# EAGLE design dim8_v3 (EAGLE 5.11)

## Sheet 1 of 2
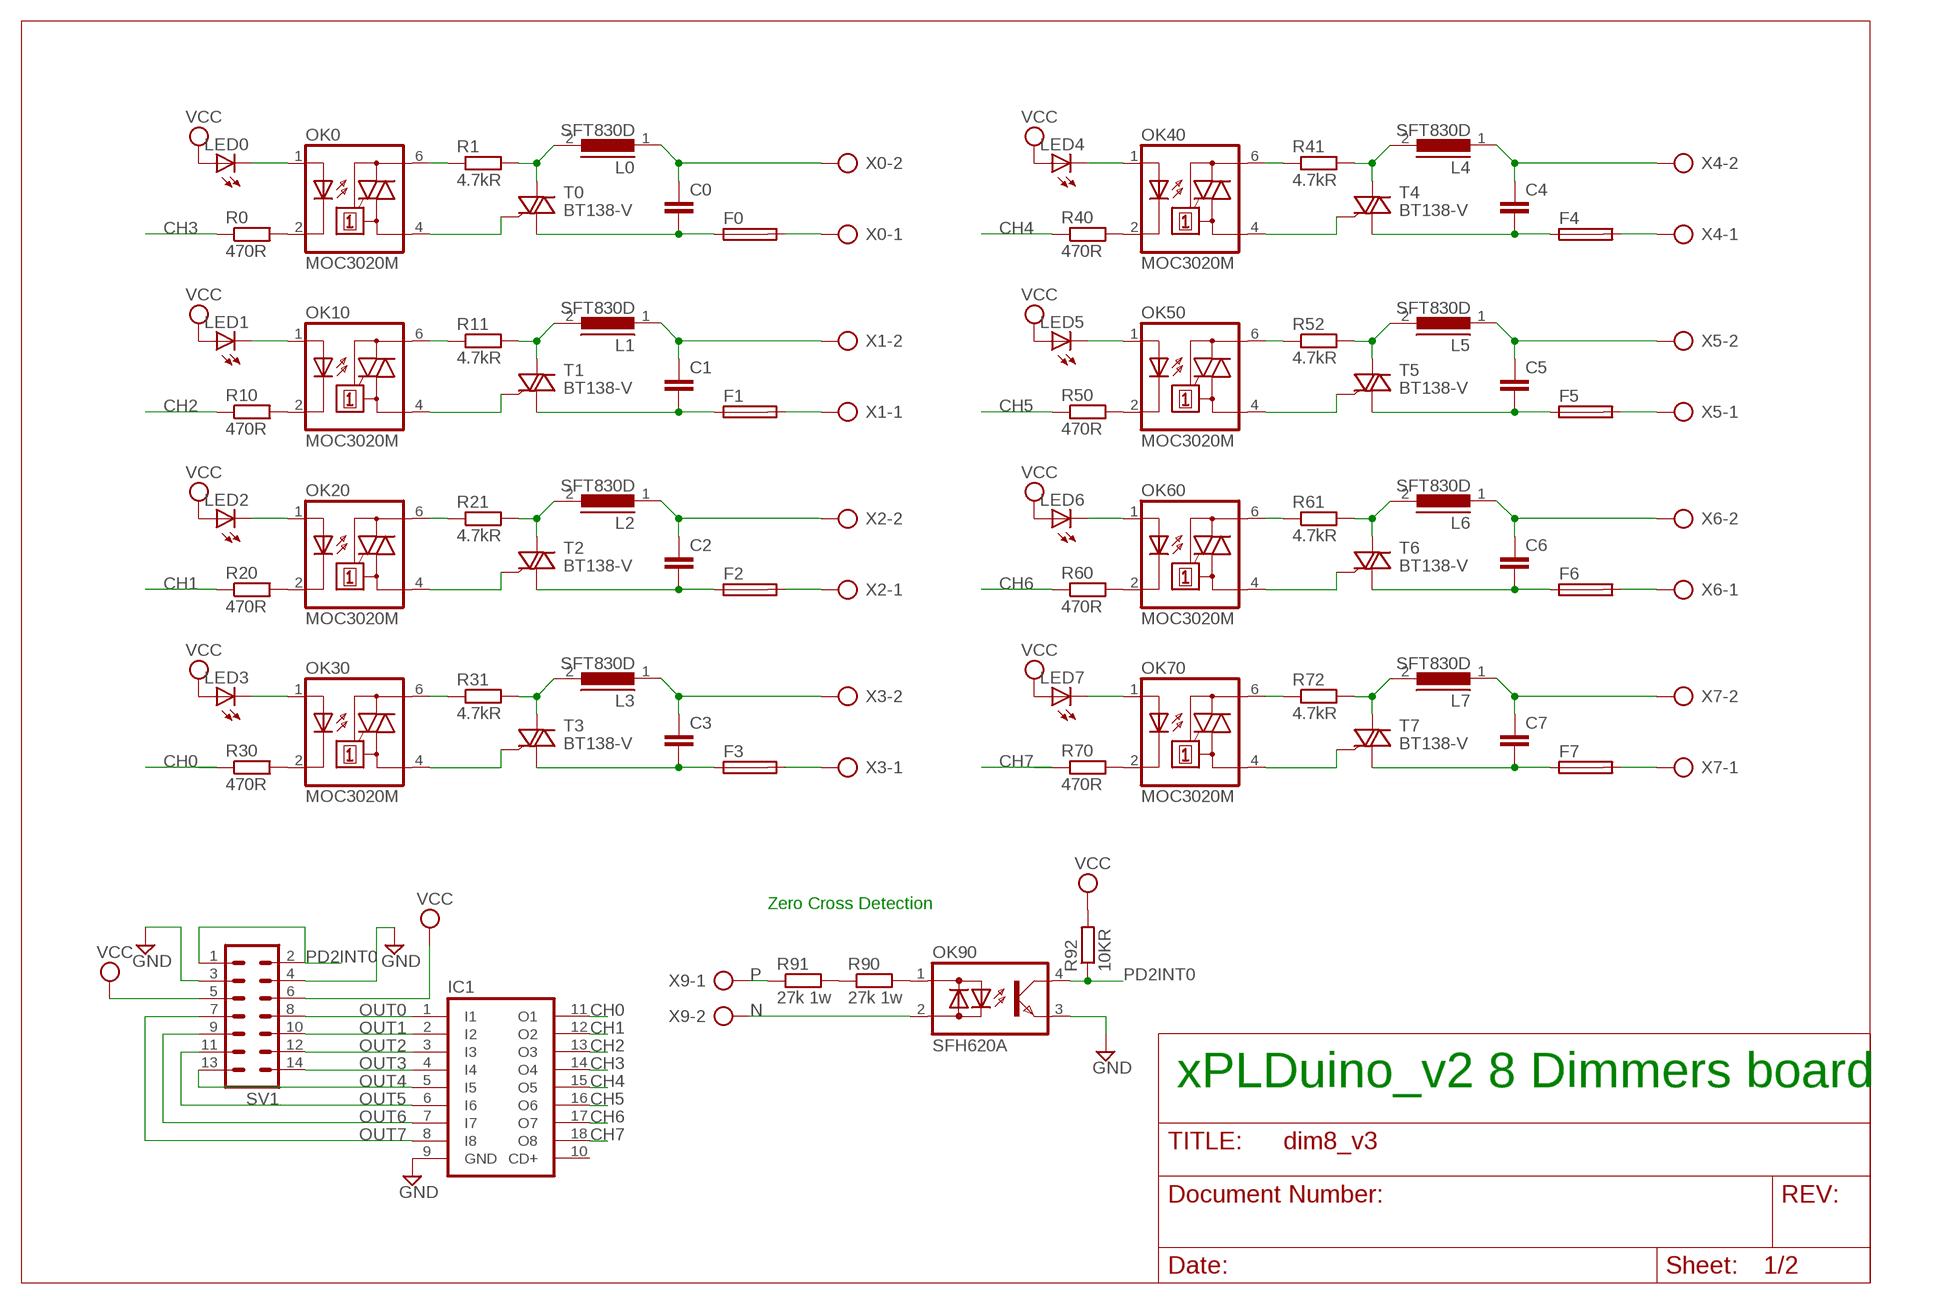
[diagram p0: schematic, sheet 1]

### Parts
C0  C10/5  [C10B5]
C1  C10/5  [C10B5]
C2  C10/5  [C10B5]
C3  C10/5  [C10B5]
C4  C10/5  [C10B5]
C5  C10/5  [C10B5]
C6  C10/5  [C10B5]
C7  C10/5  [C10B5]
F0  SH22,5A  [SH22,5A]
F1  SH22,5A  [SH22,5A]
F2  SH22,5A  [SH22,5A]
F3  SH22,5A  [SH22,5A]
F4  SH22,5A  [SH22,5A]
F5  SH22,5A  [SH22,5A]
F6  SH22,5A  [SH22,5A]
F7  SH22,5A  [SH22,5A]
IC1  ULN2803ASO18  [SO18W]
L0  SFT830D  [SFT830D]
L1  SFT830D  [SFT830D]
L2  SFT830D  [SFT830D]
L3  SFT830D  [SFT830D]
L4  SFT830D  [SFT830D]
L5  SFT830D  [SFT830D]
L6  SFT830D  [SFT830D]
L7  SFT830D  [SFT830D]
LED0  LED3MM  [LED3MM]
LED1  LED3MM  [LED3MM]
LED2  LED3MM  [LED3MM]
LED3  LED3MM  [LED3MM]
LED4  LED3MM  [LED3MM]
LED5  LED3MM  [LED3MM]
LED6  LED3MM  [LED3MM]
LED7  LED3MM  [LED3MM]
OK0  MOC3020M  [DIL06]
OK10  MOC3020M  [DIL06]
OK20  MOC3020M  [DIL06]
OK30  MOC3020M  [DIL06]
OK40  MOC3020M  [DIL06]
OK50  MOC3020M  [DIL06]
OK60  MOC3020M  [DIL06]
OK70  MOC3020M  [DIL06]
OK90  SFH620A  [DIL04]
R0  470R  R-EU_0204/7  [0204/7]
R1  4.7kR  R-EU_0204/7  [0204/7]
R10  470R  R-EU_0204/7  [0204/7]
R11  4.7kR  R-EU_0204/7  [0204/7]
R20  470R  R-EU_0204/7  [0204/7]
R21  4.7kR  R-EU_0204/7  [0204/7]
R30  470R  R-EU_0204/7  [0204/7]
R31  4.7kR  R-EU_0204/7  [0204/7]
R40  470R  R-EU_0204/7  [0204/7]
R41  4.7kR  R-EU_0204/7  [0204/7]
R50  470R  R-EU_0204/7  [0204/7]
R52  4.7kR  R-EU_0204/7  [0204/7]
R60  470R  R-EU_0204/7  [0204/7]
R61  4.7kR  R-EU_0204/7  [0204/7]
R70  470R  R-EU_0204/7  [0204/7]
R72  4.7kR  R-EU_0204/7  [0204/7]
R90  27k 1w  R-EU_0204/7  [0204/7]
R91  27k 1w  R-EU_0204/7  [0204/7]
R92  10KR  R-EU_0204/7  [0204/7]
SV1  MA07-2  [MA07-2]
T0  BT138-V  [TO220BV]
T1  BT138-V  [TO220BV]
T2  BT138-V  [TO220BV]
T3  BT138-V  [TO220BV]
T4  BT138-V  [TO220BV]
T5  BT138-V  [TO220BV]
T6  BT138-V  [TO220BV]
T7  BT138-V  [TO220BV]
X0  AK500/2-H  [AK500/2-H]
X1  AK500/2-H  [AK500/2-H]
X2  AK500/2-H  [AK500/2-H]
X3  AK500/2-H  [AK500/2-H]
X4  AK500/2-H  [AK500/2-H]
X5  AK500/2-H  [AK500/2-H]
X6  AK500/2-H  [AK500/2-H]
X7  AK500/2-H  [AK500/2-H]
X9  AK500/2-H  [AK500/2-H]

### Nets
CH0: IC1.11(O1) R30.1
CH1: IC1.12(O2) R20.1
CH2: IC1.13(O3) R10.1
CH3: IC1.14(O4) R0.1
CH4: IC1.15(O5) R40.1
CH5: IC1.16(O6) R50.1
CH6: IC1.17(O7) R60.1
CH7: IC1.18(O8) R70.1
F7 [puissance]: C7.2 F7.1 T7.T1(A1)
GND: IC1.9(GND) OK90.3(E) SV1.3 SV1.4
N: OK90.2(AC2) X9.2
N$1: OK0.4(A1) T0.G
N$2: OK0.6(A2) R1.1
N$3 [puissance]: L0.2 R1.2 T0.T2(A2)
N$4 [puissance]: C0.1 L0.1 X0.2
N$5 [puissance]: C0.2 F0.1 T0.T1(A1)
N$6: OK10.4(A1) T1.G
N$7 [puissance]: F0.2 X0.1
N$8: OK0.2(C) R0.2
N$9: LED0.K(C) OK0.1(A)
N$10: OK10.6(A2) R11.1
N$11 [puissance]: L1.2 R11.2 T1.T2(A2)
N$12 [puissance]: C1.1 L1.1 X1.2
N$13 [puissance]: C1.2 F1.1 T1.T1(A1)
N$14 [puissance]: F1.2 X1.1
N$15: OK10.2(C) R10.2
N$16: LED1.K(C) OK10.1(A)
N$17: OK20.4(A1) T2.G
N$18: OK20.6(A2) R21.1
N$19 [puissance]: L2.2 R21.2 T2.T2(A2)
N$20 [puissance]: C2.1 L2.1 X2.2
N$21 [puissance]: C2.2 F2.1 T2.T1(A1)
N$22 [puissance]: F2.2 X2.1
N$23: OK20.2(C) R20.2
N$24: LED2.K(C) OK20.1(A)
N$25: OK30.4(A1) T3.G
N$26: OK30.6(A2) R31.1
N$27 [puissance]: L3.2 R31.2 T3.T2(A2)
N$28 [puissance]: C3.1 L3.1 X3.2
N$29 [puissance]: C3.2 F3.1 T3.T1(A1)
N$30 [puissance]: F3.2 X3.1
N$31: OK30.2(C) R30.2
N$32: LED3.K(C) OK30.1(A)
N$33: OK90.1(AC1) R90.2
N$34: OK40.4(A1) T4.G
N$35: R90.1 R91.2
N$38: OK40.6(A2) R41.1
N$39 [puissance]: L4.2 R41.2 T4.T2(A2)
N$40 [puissance]: C4.1 L4.1 X4.2
N$41 [puissance]: C4.2 F4.1 T4.T1(A1)
N$42 [puissance]: F4.2 X4.1
N$43: OK40.2(C) R40.2
N$44: OK50.4(A1) T5.G
N$45: OK50.6(A2) R52.1
N$46 [puissance]: L5.2 R52.2 T5.T2(A2)
N$47 [puissance]: C5.1 L5.1 X5.2
N$48 [puissance]: C5.2 F5.1 T5.T1(A1)
N$49 [puissance]: F5.2 X5.1
N$50: OK50.2(C) R50.2
N$51: OK60.4(A1) T6.G
N$52: OK60.6(A2) R61.1
N$53 [puissance]: L6.2 R61.2 T6.T2(A2)
N$54 [puissance]: C6.1 L6.1 X6.2
N$55 [puissance]: C6.2 F6.1 T6.T1(A1)
N$56 [puissance]: F6.2 X6.1
N$57: OK60.2(C) R60.2
N$58: OK70.4(A1) T7.G
N$59: OK70.6(A2) R72.1
N$60 [puissance]: L7.2 R72.2 T7.T2(A2)
N$61 [puissance]: C7.1 L7.1 X7.2
N$63 [puissance]: F7.2 X7.1
N$64: OK70.2(C) R70.2
N$65: LED4.K(C) OK40.1(A)
N$66: LED5.K(C) OK50.1(A)
N$67: LED6.K(C) OK60.1(A)
N$68: LED7.K(C) OK70.1(A)
OUT0: IC1.1(I1) SV1.8
OUT1: IC1.2(I2) SV1.10
OUT2: IC1.3(I3) SV1.12
OUT3: IC1.4(I4) SV1.14
OUT4: IC1.5(I5) SV1.13
OUT5: IC1.6(I6) SV1.11
OUT6: IC1.7(I7) SV1.9
OUT7: IC1.8(I8) SV1.7
P: R91.1 X9.1
PD2INT0: OK90.4(C) R92.1 SV1.1 SV1.2
VCC: LED0.A LED1.A LED2.A LED3.A LED4.A LED5.A LED6.A LED7.A R92.2 SV1.5 SV1.6
Unconnected: IC1.10(CD+)

### Notes on the sheet
- Zero Cross Detection
- xPLDuino_v2 8 Dimmers board

## Sheet 2 of 2

## Library data of the parts
C0 C1-C7 = capacitor-wima:C: CAPACITOR naming: grid - package width
F0 F1-F7 = fuse:SH22,5A: FUSE HOLDER grid 22,5mm, isolated cap OGN0031 8201, Schurter (Buerklin)
IC1 = xplduino-uln-udn:ULN2803A: DRIVER ARRAY
L0 L1-L7 = inductors:SFT830D: INDUCTOR
LED0 LED1-LED7 = led:LED: LED OSRAM: - CHIPLED LG R971, LG N971, LY N971, LG Q971, LY Q971, LO R971, LY R971 LH N974, LH R974 LS Q976, LO Q976, LY Q976 LO Q996 - Hyper CHIPLED LW Q18S LB Q993, LB Q99A, LB R99A - SideLED LS A670, LO A670, LY A670, LG A670, LP A670 LB A673, LV A673, LT A673, LW A673 LH A674 LY A675 LS A676, LA A676, LO A676, LY A676, LW A676 LS A679, LY A679, LG A679 - Hyper Micro SIDELED® LS Y876, LA Y876, LO Y876, LY Y876 LT Y87S - SmartLED LW L88C, LW L88S LB L89C, LB L89S, LG L890 LS L89K, LO L89K, LY L89K LS L896, LA L896, LO L896, LY L896 - TOPLED LS T670, LO T670, LY T670, LG T670, LP T670 LSG T670, LSP T670, LSY T670, LOP T670, LYG T670 LG T671, LOG T671, LSG T671 LB T673, LV T673, LT T673, LW T673 LH T674 LS T676, LA T676, LO T676, LY T676, LB T676, LH T676, LSB T676, LW T676 LB T67C, LV T67C, LT T67C, LS T67K, LO T67K, LY T67K, LW E67C LS E67B, LA E67B, LO E67B, LY E67B, LB E67C, LV E67C, LT E67C LW T67C LS T679, LY T679, LG T679 LS T770, LO T770, LY T770, LG T770, LP T770 LB T773, LV T773, LT T773, LW T773 LH T774 LS E675, LA E675, LY E675, LS T675 LS T776, LA T776, LO T776, LY T776, LB T776 LHGB T686 LT T68C, LB T68C - Hyper Mini TOPLED® LB M676 - Mini TOPLED Santana® LG M470 LS M47K, LO M47K, LY M47K Source: http://www.osram.convergy.de LUXEON: - LUMILED® LXK2-PW12-R00, LXK2-PW12-S00, LXK2-PW14-U00, LXK2-PW14-V00 LXK2-PM12-R00, LXK2-PM12-S00, LXK2-PM14-U00 LXK2-PE12-Q00, LXK2-PE12-R00, LXK2-PE12-S00, LXK2-PE14-T00, LXK2-PE14-U00 LXK2-PB12-K00, LXK2-PB12-L00, LXK2-PB12-M00, LXK2-PB14-N00, LXK2-PB14-P00, LXK2-PB14-Q00 LXK2-PR12-L00, LXK2-PR12-M00, LXK2-PR14-Q00, LXK2-PR14-R00 LXK2-PD12-Q00, LXK2-PD12-R00, LXK2-PD12-S00 LXK2-PH12-R00, LXK2-PH12-S00 LXK2-PL12-P00, LXK2-PL12-Q00, LXK2-PL12-R00 Source: www.luxeon.com KINGBRIGHT: KA-3528ASYC Source: www.kingbright.com
OK0 OK10 OK20 OK30 OK40 OK50 OK60 OK70 = optocoupler:MOC30*M: RANDOM-PHASE OPTOISOLATORS TRIAC DRIVER OUTPUT Source: http://www.fairchildsemi.com MOC3020-M.pdf
OK90 = optocoupler:SFH620: Optocoupler, Phototransistor Output, AC Input Source: http://www.vishay.com/docs/83675/sfh620.pdf
R0 R1 R10 R11 R20 R21 R30 R31 R40 R41 R50 R52 R60 R61 R70 R72 R90-R92 = resistor:R-EU_: RESISTOR, European symbol
SV1 = con-lstb:MA07-2: PIN HEADER; OC_FARNELL: unknown; OC_NEWARK: unknown
T0 T1-T7 = triac:BT138: TRIAC Source: http://www.semiconductors.philips.com BT138_SERIES_2.pdf
X0 X1-X7 X9 = con-ptr500:AK500/2-H: CONNECTOR Aug. 2004 / PTR Meßtechnik: Die Bezeichnung der Serie AK505 wurde geändert. Es handelt sich hierbei um AK500 in horizontaler Ausführung.

## Net classes
1 puissance: width 0.254 mm, drill 0.61 mm

## Board
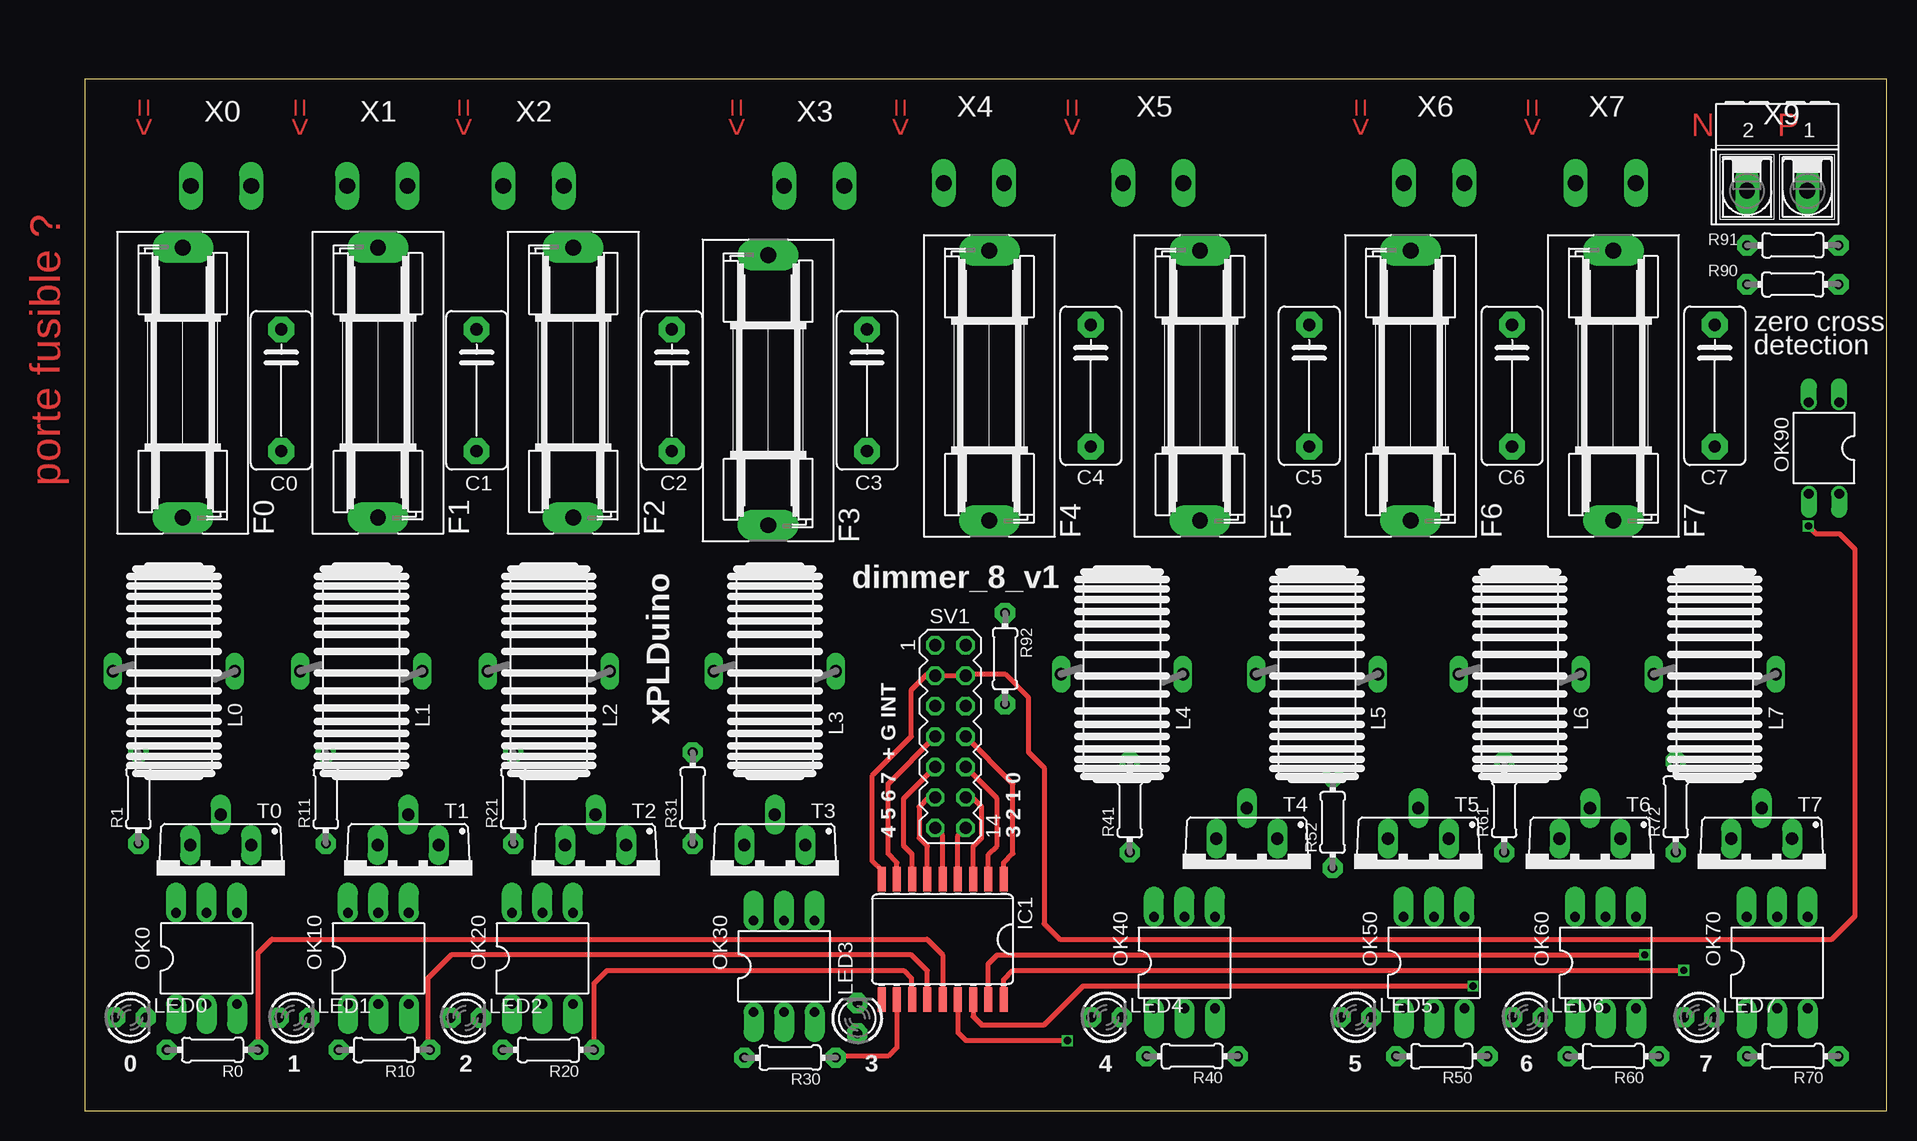
[diagram p1: board, top side]
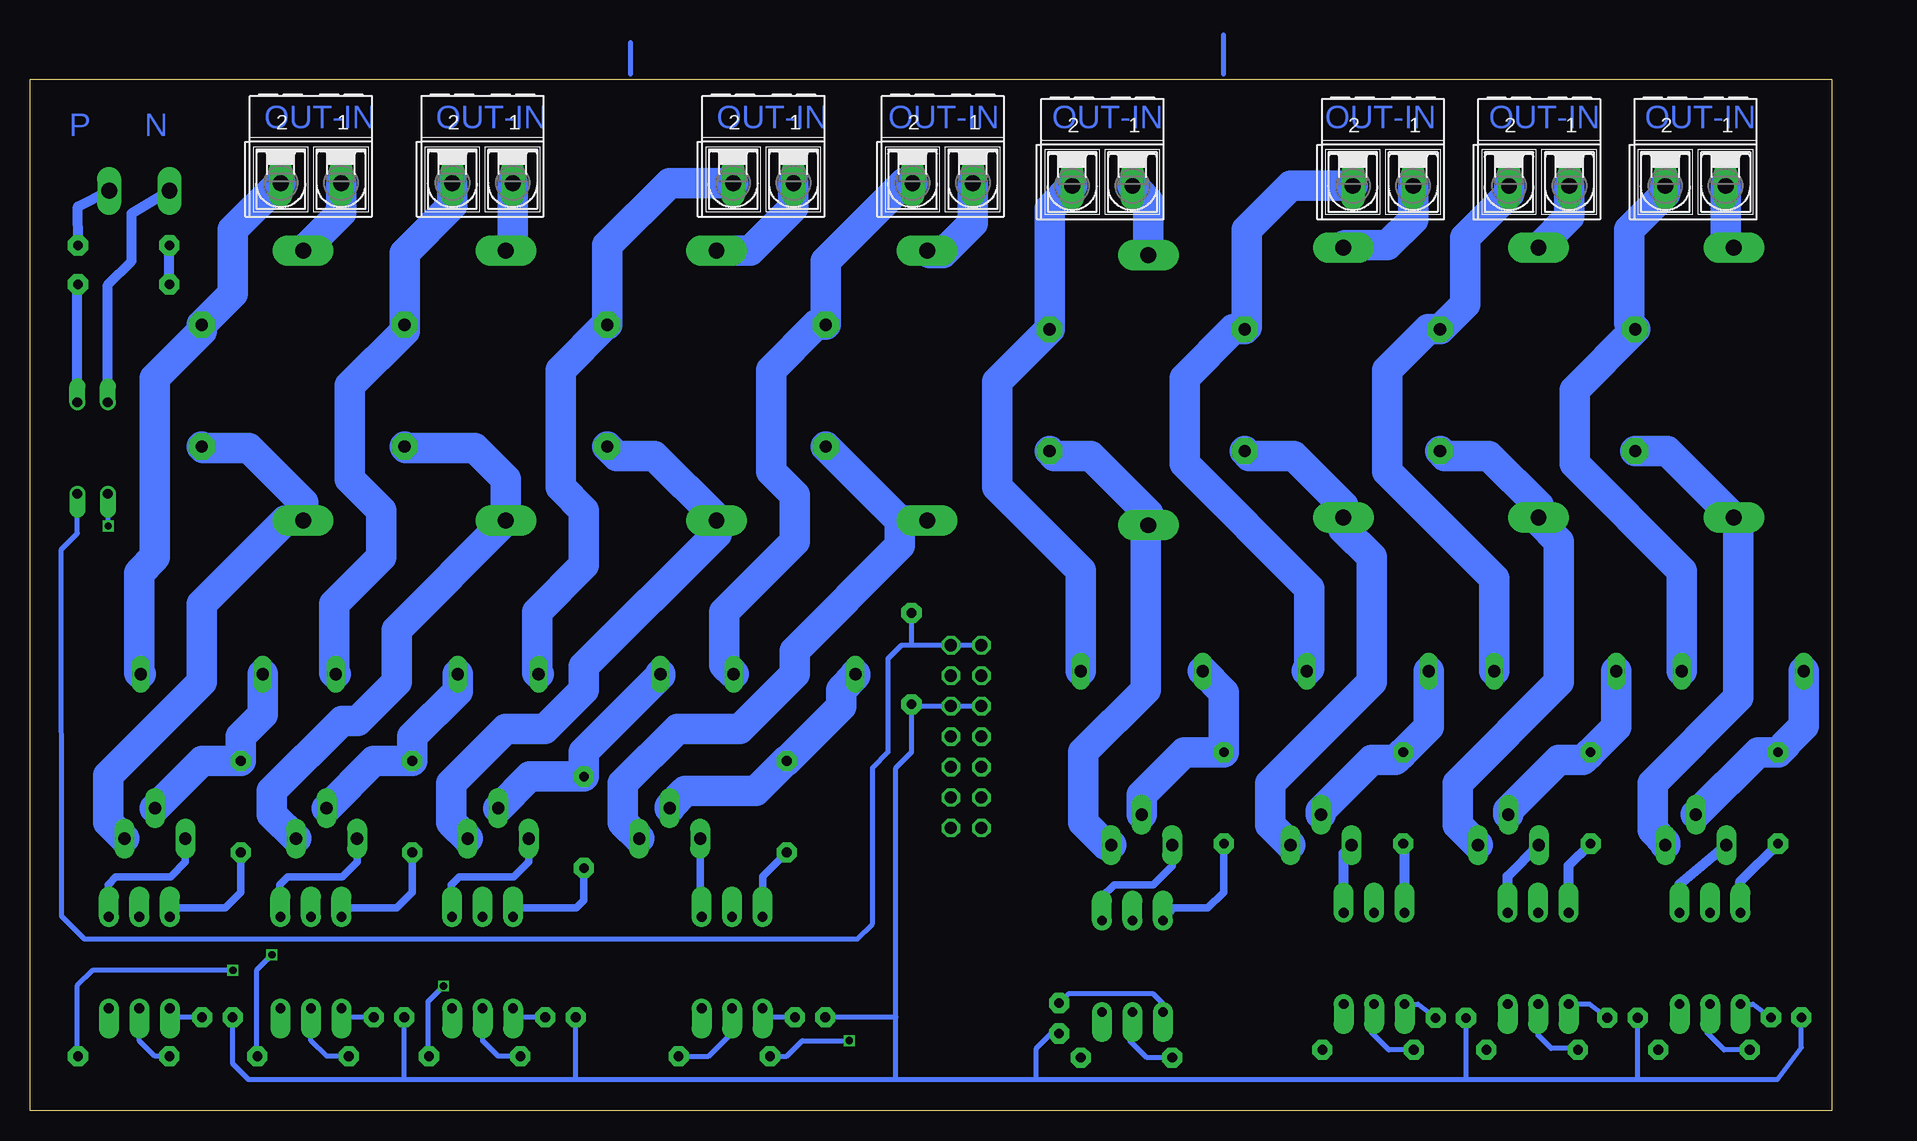
[diagram p2: board, bottom side, seen from below]

Size 150.16 x 86 mm. Coordinates in mm from the lower left corner, seen from the top.
Outline: 0,0 150.16,0 150.16,86 0,86 0,0
Copper layers (1*16): Top 0.035mm / dielectric 1.5mm / Bottom 0.035mm
Design rules "Fusion_eagle_rule_v1.1": minimum track width 6mil, minimum drill 12mil, track to track 6mil, track to pad 6mil, pad to pad 6mil, via to via 6mil, smd to smd 0mil, copper to edge 10mil, drill to drill 10mil, minimum pad ring 10mil, minimum via ring 6mil, stop-mask expansion 2mil, vias tented up to drill 100mil, thermal gap 10mil

### Footprints (pad centres in the part's own frame; a part is rotated, then mirrored left to right if it is on the bottom)
C10B5 = drill 1.016 pad 2.159 octagon: 1 -5.08,0; 2 5.08,0
SH22,5A = drill 1.321 pad 2.54 long: 1 -11.252,0; 2 11.252,0
SO18W = smd 0.66 x 2.032: 1 -5.08,-5.029; 2 -3.81,-5.029; 3 -2.54,-5.029; 4 -1.27,-5.029; 5 0,-5.029; 6 1.27,-5.029; 7 2.54,-5.029; 8 3.81,-5.029; 9 5.08,-5.029; 10 5.08,5.029; 11 3.81,5.029; 12 2.54,5.029; 13 1.27,5.029; 14 0,5.029; 15 -1.27,5.029; 16 -2.54,5.029; 17 -3.81,5.029; 18 -5.08,5.029
SFT830D = drill 1.016 long: 1 -5.08,0; 2 5.08,0
LED3MM = drill 0.813 pad 1.676 octagon: A -1.27,0; K 1.27,0
DIL06 = drill 0.813 pad 1.676 offset: 1 -2.54,-3.81; 2 0,-3.81; 3 2.54,-3.81; 4 2.54,3.81; 5 0,3.81; 6 -2.54,3.81
DIL04 = drill 0.813 offset: 1 -1.27,-3.81; 2 1.27,-3.81; 3 1.27,3.81; 4 -1.27,3.81
0204/7 = drill 0.813 pad 1.676 octagon: 1 -3.81,0; 2 3.81,0
MA07-2 = drill 1.016 octagon: 1 -7.62,-1.27; 2 -7.62,1.27; 3 -5.08,-1.27; 4 -5.08,1.27; 5 -2.54,-1.27; 6 -2.54,1.27; 7 0,-1.27; 8 0,1.27; 9 2.54,-1.27; 10 2.54,1.27; 11 5.08,-1.27; 12 5.08,1.27; 13 7.62,-1.27; 14 7.62,1.27
TO220BV = drill 1.016 pad 1.676 long: G 2.54,-2.54; T1 -2.54,-2.54; T2 0,-5.08
AK500/2-H = drill 1.321 long: 1 -2.515,0; 2 2.515,0

### Placement (x,y rotation side)
C0  16.39,60.07 270 top
C1  32.66,60.07 270 top
C2  48.93,60.07 270 top
C3  65.2,60.07 270 top
C4  83.85,60.45 270 top
C5  102.05,60.45 270 top
C6  118.95,60.45 270 top
C7  135.85,60.45 270 top
F0  8.18,60.72 90 top
F1  24.45,60.72 90 top
F2  40.72,60.72 90 top
F3  56.96,60.07 90 top
F4  75.4,60.45 90 top
F5  92.95,60.45 90 top
F6  110.5,60.45 90 top
F7  127.4,60.45 90 top
IC1  71.5,14.3 180 top
L0  7.44,36.65 180 top
L1  23.06,36.65 180 top
L2  38.68,36.65 180 top
L3  57.52,36.65 180 top
L4  86.45,36.4 180 top
L5  102.7,36.4 180 top
L6  119.6,36.4 180 top
L7  135.85,36.4 180 top
LED0  3.81,7.78 0 top
LED1  17.46,7.76 0 top
LED2  31.76,7.74 0 top
LED3  64.4,7.71 90 top
LED4  85.15,7.8 0 top
LED5  105.95,7.8 0 top
LED6  120.25,7.8 0 top
LED7  134.55,7.8 0 top
OK0  10.16,12.7 0 top
OK10  24.48,12.7 0 top
OK20  38.15,12.7 0 top
OK30  58.29,12.05 0 top
OK40  91.65,12.35 0 top
OK50  112.45,12.35 0 top
OK60  126.75,12.35 0 top
OK70  141.05,12.35 0 top
OK90  144.95,55.25 180 top
R0  10.66,5.08 180 top
R1  4.49,26.08 90 top
R10  24.98,5.08 180 top
R11  20.11,26.08 90 top
R20  38.65,5.08 180 top
R21  35.73,26.08 90 top
R30  58.79,4.43 180 top
R31  50.67,26.08 90 top
R40  92.3,4.55 0 top
R41  87.1,25.35 90 top
R50  113.1,4.55 180 top
R52  104,24.05 90 top
R60  127.4,4.55 180 top
R61  118.3,25.35 90 top
R70  142.35,4.55 180 top
R72  132.6,25.35 90 top
R90  142.35,68.9 0 top
R91  142.35,72.15 180 top
R92  76.7,37.7 270 top
SV1  72.15,31.2 270 top
T0  11.34,19.61 180 top
T1  26.96,19.61 180 top
T2  42.58,19.61 180 top
T3  57.52,19.61 180 top
T4  96.85,20.15 180 top
T5  111.15,20.15 180 top
T6  125.45,20.15 180 top
T7  139.75,20.15 180 top
X0  11.37,77.11 180 bottom
X1  24.39,77.11 180 bottom
X2  37.41,77.11 180 bottom
X3  60.8,77.11 180 bottom
X4  74.1,77.35 180 bottom
X5  89.05,77.35 180 bottom
X6  112.45,77.35 180 bottom
X7  126.75,77.35 180 bottom
X9  141.05,76.7 180 top

### Tracks (layer width: path | path; a pad name or v marks a point on that pad's centre or on a via)
CH0
  Top 0.406: IC1.11 67.69,5.29 66.95,4.55 62.72,4.55 R30.1
CH1
  Top 0.406: R20.1 42.46,10.61 43.55,11.7 68.25,11.7 68.9,11.05 68.9,9.33 IC1.12
CH2
  Top 0.406: IC1.13 70.23,11.67 68.9,13 30.55,13 28.6,11.05 28.6,5.27 R10.1
CH3
  Top 0.406: R0.1 14.47,13.17 15.6,14.3 70.2,14.3 71.5,13 IC1.14
CH4  (via drill 0.6)
  Top 0.406: v81.9,5.85 73.45,5.85 72.8,6.5 72.8,9.24 IC1.15
  Bottom 0.406: R40.1 87.1,4.55 85.8,5.85 v81.9,5.85
CH5  (via drill 0.6)
  Top 0.406: IC1.16 74.04,7.86 74.75,7.15 79.95,7.15 83.2,10.4 v115.7,10.4
  Bottom 0.406: v115.7,10.4 117,9.1 117,4.64 R50.1
CH6  (via drill 0.6)
  Top 0.406: IC1.17 75.31,12.26 76.05,13 v130,13
  Bottom 0.406: v130,13 131.3,11.7 131.3,4.64 R60.1
CH7  (via drill 0.6)
  Top 0.406: IC1.18 76.58,10.93 77.35,11.7 v133.25,11.7
  Bottom 0.406: v133.25,11.7 144.95,11.7 146.25,10.4 146.25,4.64 R70.1
F7
  Bottom 2.54: C7.2 135.73,55.25 131.95,55.25 127.4,50.7 F7.1 128.9,49.2 135.85,42.25 135.85,35.75 143.65,27.95 143.65,24.05 T7.T1
GND  (via drill 0.6)
  Top 0.406: v143.65,48.75 144.3,48.1 146.25,48.1 147.55,46.8 147.55,16.25 145.6,14.3 81.25,14.3 79.95,15.6 79.95,28.6 78.65,29.9 78.65,34.45 76.7,36.4 73.54,36.4 SV1.4 SV1.3 70.76,36.4 70.2,36.4 68.9,35.1 68.9,31.2 65.65,27.95 65.65,20.8 66.42,20.03 IC1.9
  Bottom 0.406: v143.65,48.75 143.65,51.41 143.68,51.41 OK90.3
N
  Bottom 0.813: X9.2 141.7,74.83 141.7,70.85 143.68,68.87 OK90.2
N$1
  Bottom 0.813: OK0.4 12.7,18.9 T0.G
N$2
  Bottom 0.813: OK0.6 7.62,19.14 R1.1
N$3
  Bottom 2.54: L0.2 2.36,32.09 3.9,30.55 3.9,30.48 R1.2 6.14,29.89 T0.T2
N$4
  Bottom 2.54: X0.2 13.88,76.47 16.9,73.45 16.9,65.66 C0.1 21.45,60.09 21.45,53.95 12.52,45.02 L0.1
N$5
  Bottom 2.54: C0.2 13.7,54.99 F0.1 7.8,49.09 7.8,34.45 14.95,27.3 14.95,23.4 13.88,22.33 T0.T1
N$6
  Bottom 0.813: OK10.4 27.02,19.55 T1.G
N$7
  Bottom 2.54: X0.1 8.86,72.65 F0.2
N$8
  Bottom 0.406: R0.2 8.98,5.08 10.4,6.5 10.4,8.65 OK0.2
N$9
  Bottom 0.406: OK0.1 6.57,8.89 LED0.K
N$10
  Bottom 0.813: OK10.6 21.94,20.44 R11.1
N$11
  Bottom 2.54: T1.T2 26.96,25.04 22.75,29.25 20.75,29.25 R11.2 17.98,32.02 L1.2
N$12
  Bottom 2.54: X1.2 26.91,76.44 30.55,72.8 30.55,67.26 C1.1 33.65,65.15 37.05,61.75 37.05,53.3 28.14,44.39 L1.1
N$13
  Bottom 2.54: C1.2 32.27,54.6 28.6,54.6 24.45,50.45 F1.1 24.45,49.15 22.75,47.45 22.75,35.75 31.2,27.3 31.2,23.85 T1.T1
N$14
  Bottom 2.54: X1.1 21.88,74.55 F1.2
N$15
  Bottom 0.406: OK10.2 24.48,6.28 23.4,5.2 21.29,5.2 R10.2
N$16
  Bottom 0.406: OK10.1 20.2,8.89 LED1.K
N$17
  Bottom 0.813: OK20.4 40.69,21.5 T2.G
N$18
  Bottom 0.813: OK20.6 35.61,22.15 R21.1
N$19
  Bottom 2.54: T2.T2 42.58,25.02 38.35,29.25 36.37,29.25 R21.2 33.6,32.02 L2.2
N$20
  Bottom 2.54: X2.2 45.09,77.11 48.75,73.45 48.75,65.33 C2.1 49.9,65.15 53.95,61.1 53.95,53.95 43.55,43.55 43.55,36.86 L2.1
N$21
  Bottom 2.54: C2.2 48.54,54.6 44.85,54.6 40.72,50.47 F2.1 40.72,48.52 38.35,46.15 38.35,35.75 46.8,27.3 46.8,23.83 T2.T1
N$22
  Bottom 2.54: X2.1 34.9,74.31 37.05,72.15 40.54,72.15 F2.2
N$23
  Bottom 0.406: R20.2 36.93,5.08 38.35,6.5 38.35,8.69 OK20.2
N$24
  Bottom 0.406: OK20.1 34.48,8.89 LED2.K
N$25
  Bottom 0.61: OK30.4 60.83,17.82 59.8,18.85 56.55,18.85 54.98,20.42 T3.G
N$26
  Bottom 0.61: R31.1 50.67,18.23 52,16.9 54.84,16.9 OK30.6
N$27
  Bottom 2.54: L3.2 50.67,34.88 R31.2 53.96,29.89 57.52,26.33 T3.T2
N$28
  Bottom 2.54: X3.2 65.2,75.22 C3.1 69.55,60.8 69.55,52 62.6,45.05 L3.1
N$29
  Bottom 2.54: C3.2 64.81,54.6 61.75,54.6 56.96,49.81 F3.1 57.2,48.58 57.2,35.1 62.4,29.9 62.4,24.05 60.5,22.15 T3.T1
N$30
  Bottom 2.54: F3.2 56.96,75.81 57.85,76.7 57.88,76.7 X3.1
N$31
  Bottom 0.406: R30.2 57.08,4.43 58.5,5.85 58.5,8.03 OK30.2
N$32
  Bottom 0.406: OK30.1 55.75,8.95 56.55,9.75 63.63,9.75 LED3.K
N$33
  Bottom 0.813: R90.2 146.22,68.84 OK90.1
N$34
  Bottom 0.61: T4.G 94.31,16.28 OK40.4
N$35
  Bottom 0.813: R90.1 R91.2
N$36
  Bottom 0.406: 50.7,86.45 50.7,89.7
N$37
  Bottom 0.406: 100.1,86.45 100.1,89.05
N$38
  Bottom 0.61: OK40.6 89.11,19.53 R41.1
N$39
  Bottom 2.54: L4.2 81.37,36.28 82.55,35.1 82.55,33.71 R41.2 87.19,29.16 89.7,26.65 95.55,26.65 96.85,25.35 T4.T2
N$40
  Bottom 2.54: X4.2 77.35,77.35 83.85,70.85 C4.1 84.62,65.53 88.4,61.75 88.4,53.3 86.45,51.35 86.45,47.45 92.3,41.6 92.3,37.17 L4.1
N$41
  Bottom 2.54: 77.68,49.2 F4.1 | 77.68,49.2 C4.2 | 77.68,49.2 77.68,47.12 86.45,38.35 86.45,36.4 91,31.85 96.2,31.85 100.75,27.3 100.75,24.05 T4.T1
N$42
  Bottom 2.54: X4.1 71.58,74.02 74.1,71.5 75.2,71.5 F4.2
N$43
  Bottom 0.406: R40.2 93.6,4.55 91.65,6.5 OK40.2
N$44
  Bottom 0.61: T5.G 108.61,20.74 109.85,19.5 114.4,19.5 115.05,18.85 115.05,16.22 OK50.4
N$45
  Bottom 0.61: R52.1 104,17.55 104.65,16.9 109.85,16.9 109.85,16.22 OK50.6
N$46
  Bottom 2.54: L5.2 97.62,36.28 104,29.9 R52.2 108.52,27.86 T5.T2
N$47
  Bottom 2.54: X5.2 96.85,77.35 102.05,72.15 C5.1 102.17,65.53 105.95,61.75 105.95,52 104,50.05 104,45.5 107.9,41.6 107.9,36.52 L5.1
N$48
  Bottom 2.54: C5.2 101.28,54.6 98.15,54.6 92.95,49.4 F5.1 92.95,48.1 104,37.05 104,35.1 107.25,31.85 110.5,31.85 115.05,27.3 115.05,24.05 T5.T1
N$49
  Bottom 2.54: X5.1 86.53,75.31 90.15,71.7 F5.2
N$50
  Bottom 0.406: R50.2 111.15,4.55 112.45,5.85 OK50.2
N$51
  Bottom 0.61: T6.G 122.91,20.74 124.15,19.5 128.7,19.5 129.35,18.85 129.35,16.22 OK60.4
N$52
  Bottom 0.61: R61.1 118.3,18.2 119.6,16.9 123.47,16.9 OK60.6
N$53
  Bottom 2.54: L6.2 114.52,34.98 118.3,31.2 R61.2 121.52,29.16 T6.T2
N$54
  Bottom 2.54: X6.2 114.97,75.48 118.95,71.5 C6.1 118.95,65 123.5,60.45 123.5,52.65 120.9,50.05 120.9,46.15 124.8,42.25 124.8,36.52 L6.1
N$55
  Bottom 2.54: C6.2 118.83,55.25 113.1,55.25 110.5,52.65 F6.1 119.6,40.1 119.6,35.75 122.85,32.5 124.15,32.5 130,26.65 130,24.7 T6.T1
N$56
  Bottom 2.54: X6.1 109.94,72.27 F6.2
N$57
  Bottom 0.406: R60.2 125.45,4.55 126.75,5.85 OK60.2
N$58
  Bottom 0.61: T7.G 137.21,20.74 138.45,19.5 143,19.5 143.65,18.85 143.65,16.22 OK70.4
N$59
  Bottom 0.61: R72.1 132.6,18.2 133.9,16.9 137.77,16.9 OK70.6
N$60
  Bottom 2.54: L7.2 130.77,33.03 132.6,31.2 R72.2 135.82,29.16 T7.T2
N$61
  Bottom 2.54: X7.2 129.35,77.35 133.25,73.45 133.25,68.13 C7.1 135.85,65 139.75,61.1 139.75,46.15 141.05,44.85 141.05,36.52 L7.1
N$63
  Bottom 2.54: X7.1 124.23,74.87 F7.2
N$64
  Bottom 0.406: OK70.2 141.05,5.85 139.75,4.55 R70.2
N$65
  Bottom 0.406: LED4.K 88.37,7.8 OK40.1
N$66
  Bottom 0.406: LED5.K 109.17,7.8 OK50.1
N$67
  Bottom 0.406: LED6.K 123.47,7.8 OK60.1
N$68
  Bottom 0.406: LED7.K 137.77,7.8 OK70.1
OUT0
  Top 0.406: IC1.1 76.58,20.68 77.35,21.45 77.35,27.27 SV1.8
OUT1
  Top 0.406: IC1.2 75.31,21.36 76.05,22.1 76.05,26.03 SV1.10
OUT2
  Top 0.406: IC1.3 74.04,22.04 74.75,22.75 74.75,25.35 74.1,26 73.54,26 SV1.12
OUT3
  Top 0.406: IC1.4 72.77,22.93 SV1.14
OUT4
  Top 0.406: IC1.5 71.5,22.96 SV1.13
OUT5
  Top 0.406: IC1.6 70.23,22.07 69.55,22.75 69.55,25.35 70.32,26.12 SV1.11
OUT6
  Top 0.406: IC1.7 68.96,21.39 68.25,22.1 68.25,26.03 SV1.9
OUT7
  Top 0.406: IC1.8 67.69,20.71 66.95,21.45 66.95,27.27 SV1.7
P
  Bottom 0.813: R91.1 146.16,75.39 X9.1
PD2INT0
  Bottom 0.406: OK90.4 146.22,48.13 147.55,46.8 147.52,16.22 145.6,14.3 81.25,14.3 79.95,15.6 79.95,28.6 78.65,29.9 78.65,37.7 77.53,38.82 76.7,38.82 | SV1.1 SV1.2 76.7,38.82 | 76.7,38.82 R92.1
VCC
  Bottom 0.406: LED0.A 2.54,5.26 4.55,2.6 16.25,2.6 | 16.25,2.6 30.55,2.6 | LED1.A 16.19,2.66 16.25,2.6 | LED2.A 30.49,2.66 30.55,2.6 | 30.55,2.6 66.3,2.6 | 66.3,2.6 78,2.6 | SV1.5 SV1.6 76.55,33.74 R92.2 76.7,29.9 78,28.6 78,7.8 | LED3.A 65.06,6.44 66.3,5.2 66.3,2.6 | 78,2.6 78,7.8 | 78,2.6 104.65,2.6 | 104.65,2.6 118.95,2.6 | 118.95,2.6 131.95,2.6 133.25,3.9 133.25,7.77 LED7.A | LED6.A 118.98,2.63 118.95,2.6 | LED5.A 104.68,2.63 104.65,2.6 | 78,7.8 LED4.A

### Text on the board
Top: <= | <= | <= | <= | <= | <= | <= | <= | N P | porte fusible ?
Bottom: OUT-IN | OUT-IN | OUT-IN | OUT-IN | OUT-IN | OUT-IN | OUT-IN | OUT-IN | P N
tNames: zero cross | detection | dimmer_8_v1 | xPLDuino | 4 5 6 7 + G INT | 3 2 1 0 | 0 | 1 | 2 | 3 | 4 | 5 | 6 | 7